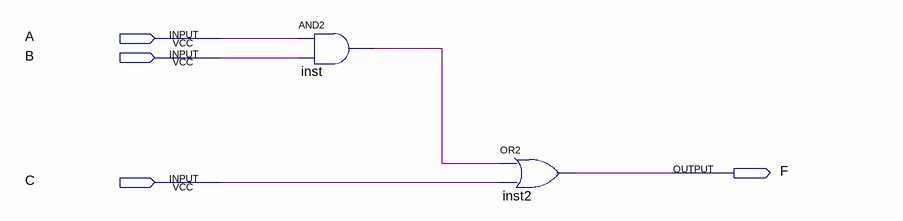
[diagram p0: schematic sheet]
// Quartus schematic temp_01.bdf as structural Verilog: 2 symbols, 4 pins
module temp_01 (
  input  A,
  input  B,
  input  C,
  output F
);

  wire inst_out;

  and inst (inst_out, A, B);
  or inst2 (F, inst_out, C);
endmodule
